# EAGLE design modular_expansion_system_esp32 (EAGLE 9.2.1)
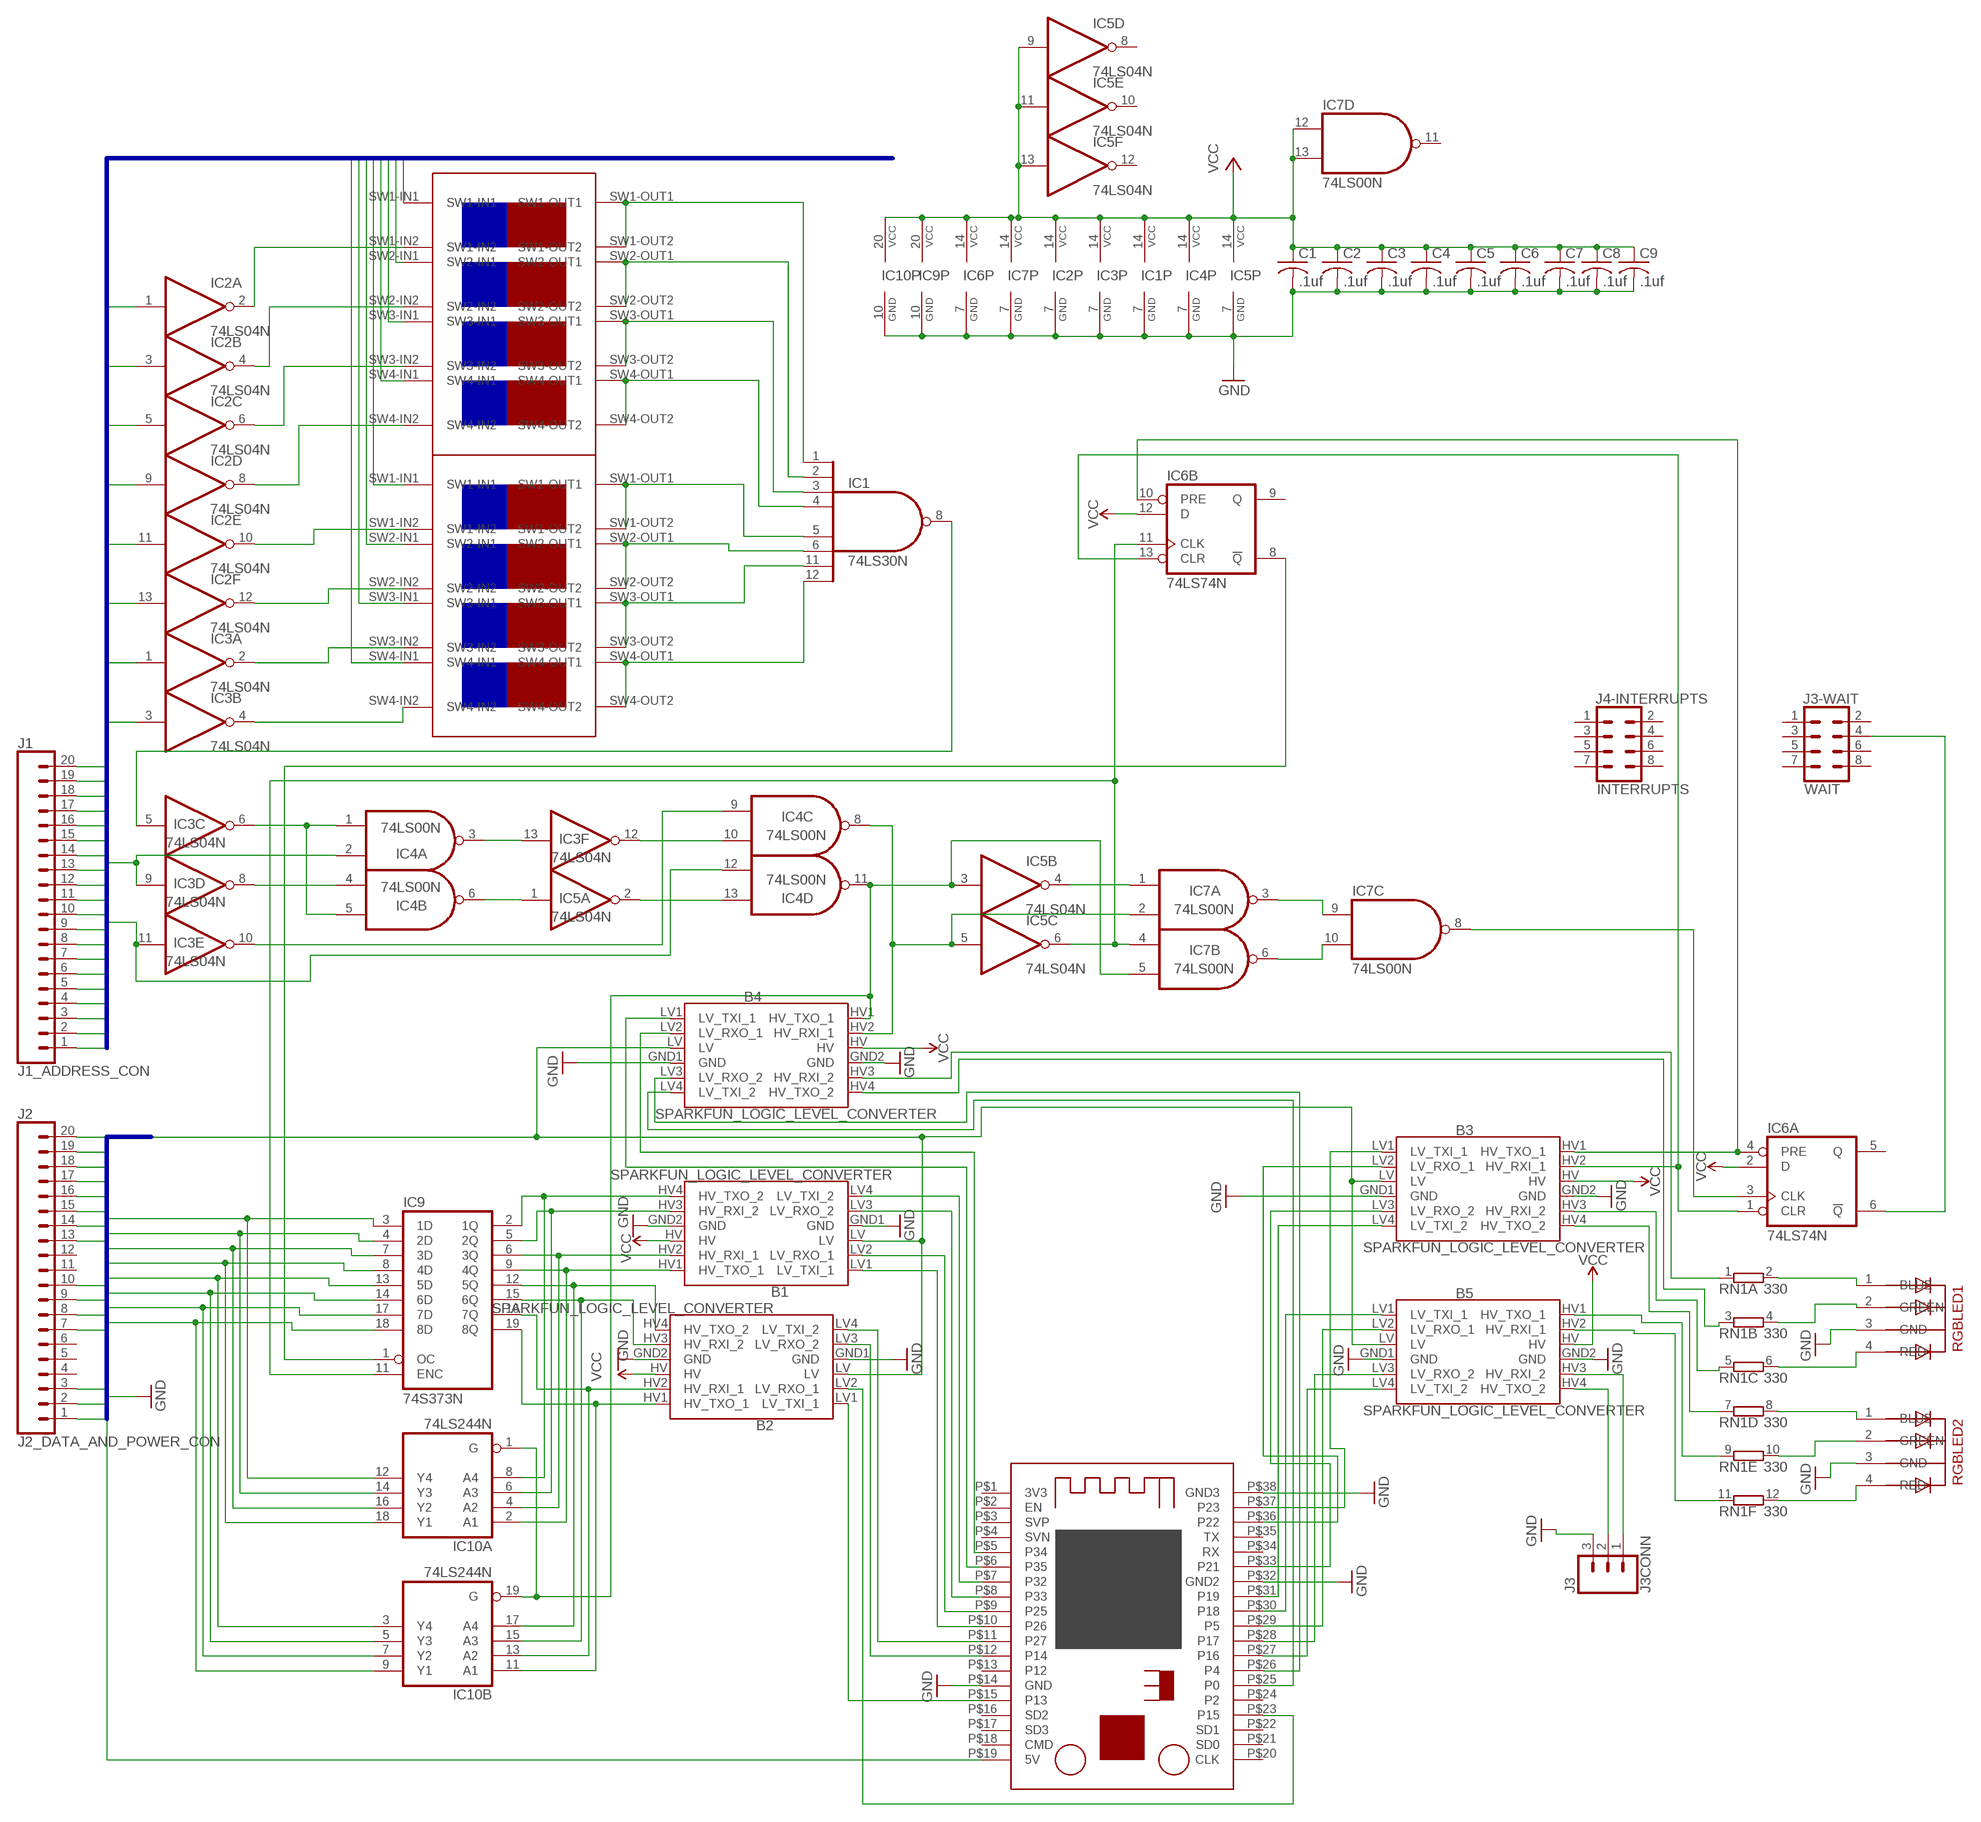
[diagram p0: schematic, sheet 1]

## Parts
B1  SPARKFUN_LOGIC_LEVEL_CONVERTER  [SPARKFUN_LOGIC_LEVEL_CONVERTER]
B2  SPARKFUN_LOGIC_LEVEL_CONVERTER  [SPARKFUN_LOGIC_LEVEL_CONVERTER]
B3  SPARKFUN_LOGIC_LEVEL_CONVERTER  [SPARKFUN_LOGIC_LEVEL_CONVERTER]
B4  SPARKFUN_LOGIC_LEVEL_CONVERTER  [SPARKFUN_LOGIC_LEVEL_CONVERTER]
B5  SPARKFUN_LOGIC_LEVEL_CONVERTER  [SPARKFUN_LOGIC_LEVEL_CONVERTER]
C1  .1uf  C-US025-025X050  [C025-025X050]
C2  .1uf  C-US025-025X050  [C025-025X050]
C3  .1uf  C-US025-025X050  [C025-025X050]
C4  .1uf  C-US025-025X050  [C025-025X050]
C5  .1uf  C-US025-025X050  [C025-025X050]
C6  .1uf  C-US025-025X050  [C025-025X050]
C7  .1uf  C-US025-025X050  [C025-025X050]
C8  .1uf  C-US025-025X050  [C025-025X050]
C9  .1uf  C-US025-025X050  [C025-025X050]
IC1  74LS30N  [DIL14]
IC2  74LS04N  [DIL14]
IC3  74LS04N  [DIL14]
IC4  74LS00N  [DIL14]
IC5  74LS04N  [DIL14]
IC6  74LS74N  [DIL14]
IC7  74LS00N  [DIL14]
IC9  74S373N  [DIL20]
IC10  74LS244N  [DIL20]
J1  J1_ADDRESS_CON  CONN_20  [1X20]
J2  J2_DATA_AND_POWER_CON  CONN_20  [1X20]
J3  J3CONN  CONN_03  [1X03]
J3-WAIT  WAIT  CONN_04X2  [2X4]
J4-INTERRUPTS  INTERRUPTS  CONN_04X2  [2X4]
RGBLED1  5MMRGBLED  [LED5MMRGB]
RGBLED2  5MMRGBLED  [LED5MMRGB]
RN1  330  E6R  [SIL12]
SW1  CTS206-124  [CTS206-124]
SW2  CTS206-124  [CTS206-124]
U$1  ESP32S  [ESP32S]

## Nets
A0: IC3.3(B:I) J1.1 SW1.SW4-IN1
A0_OR_NOT_A0: IC1.12(I7) SW1.SW4-OUT1 SW1.SW4-OUT2
A1: IC3.1(A:I) J1.2 SW1.SW3-IN1
A1_OR_NOT_A1: IC1.11(I6) SW1.SW3-OUT1 SW1.SW3-OUT2
A2: IC2.13(F:I) J1.3 SW1.SW2-IN1
A2_OR_NOT_A2: IC1.6(I5) SW1.SW2-OUT1 SW1.SW2-OUT2
A3: IC2.11(E:I) J1.4 SW1.SW1-IN1
A3_OR_NOT_A3: IC1.5(I4) SW1.SW1-OUT1 SW1.SW1-OUT2
A4: IC2.9(D:I) J1.5 SW2.SW4-IN1
A4_OR_NOT_A4: IC1.4(I3) SW2.SW4-OUT1 SW2.SW4-OUT2
A5: IC2.5(C:I) J1.6 SW2.SW3-IN1
A5_OR_NOT_A5: IC1.3(I2) SW2.SW3-OUT1 SW2.SW3-OUT2
A6: IC2.3(B:I) J1.7 SW2.SW2-IN1
A6_OR_NOT_A6: IC1.2(I1) SW2.SW2-OUT1 SW2.SW2-OUT2
A7: IC2.1(A:I) J1.8 SW2.SW1-IN1
A7_OR_NOT_A7: IC1.1(I0) SW2.SW1-OUT1 SW2.SW1-OUT2
A8: J1.9
A9: J1.10
A10: J1.11
A11: J1.12
A12: J1.13
A13: J1.14
A14: J1.15
A15: J1.16
ADDRESS_SELECTED: IC3.6(C:O) IC4.1(A:I0) IC4.5(B:I1)
ADDRESS_SELECTED_: IC1.8(O) IC3.5(C:I)
CAS*: J2.9
D0: IC9.18(8D) IC10.9(B:Y1) J2.20
D0_HV: B2.HV1(HV_TXO_1) IC9.19(8Q) IC10.11(B:A1)
D0_LV: B2.LV1(LV_TXI_1) U$1.P$15(P13)
D1: IC9.17(7D) IC10.7(B:Y2) J2.19
D1_HV: B2.HV2(HV_RXI_1) IC9.16(7Q) IC10.13(B:A2)
D1_LV: B2.LV2(LV_RXO_1) U$1.P$23(P15)
D2: IC9.14(6D) IC10.5(B:Y3) J2.18
D2_HV: B2.HV3(HV_RXI_2) IC9.15(6Q) IC10.15(B:A3)
D2_LV: B2.LV3(LV_RXO_2) U$1.P$12(P14)
D3: IC9.13(5D) IC10.3(B:Y4) J2.17
D3_HV: B2.HV4(HV_TXO_2) IC9.12(5Q) IC10.17(B:A4)
D3_LV: B2.LV4(LV_TXI_2) U$1.P$11(P27)
D4: IC9.8(4D) IC10.18(A:Y1) J2.16
D4_HV: B1.HV1(HV_TXO_1) IC9.9(4Q) IC10.2(A:A1)
D4_LV: B1.LV1(LV_TXI_1) U$1.P$10(P26)
D5: IC9.7(3D) IC10.16(A:Y2) J2.15
D5_HV: B1.HV2(HV_RXI_1) IC9.6(3Q) IC10.4(A:A2)
D5_LV: B1.LV2(LV_RXO_1) U$1.P$9(P25)
D6: IC9.4(2D) IC10.14(A:Y3) J2.14
D6_HV: B1.HV3(HV_RXI_2) IC9.5(2Q) IC10.6(A:A3)
D6_LV: B1.LV3(LV_RXO_2) U$1.P$8(P33)
D7: IC9.3(1D) IC10.12(A:Y4) J2.13
D7_HV: B1.HV4(HV_TXO_2) IC9.2(1Q) IC10.8(A:A4)
D7_LV: B1.LV4(LV_TXI_2) U$1.P$7(P32)
GND: B1.GND1(GND) B1.GND2(GND) B2.GND1(GND) B2.GND2(GND) B3.GND1(GND) B3.GND2(GND) B4.GND1(GND) B4.GND2(GND) B5.GND1(GND) B5.GND2(GND) C1.2 C2.2 C3.2 C4.2 C5.2 C6.2 C7.2 C8.2 C9.2 IC1.7(GND) IC2.7(P:GND) IC3.7(P:GND) IC4.7(P:GND) IC5.7(P:GND) IC6.7(P:GND) IC7.7(P:GND) IC9.10(GND) IC10.10(P:GND) J2.2 J3.3 RGBLED1.3(GND) RGBLED2.3(GND) U$1.P$14(GND) U$1.P$32(GND2) U$1.P$38(GND3)
IC6_CLR_HV: B3.HV2(HV_RXI_1) IC6.1(A:CLR) IC6.13(B:CLR)
IC6_PRE_HV: B3.HV1(HV_TXO_1) IC6.4(A:PRE) IC6.10(B:PRE)
IC6A_CLR_LV: B3.LV2(LV_RXO_1) U$1.P$36(P22)
IC6A_PRE_LV: B3.LV1(LV_TXI_1) U$1.P$37(P23)
IN: IC3.8(D:O) IC4.4(B:I0)
IN_: IC3.9(D:I) IC4.2(A:I1) J1.17
INTAK*: J2.7
N$12: IC3.13(F:I) IC4.3(A:O)
N$13: IC4.6(B:O) IC5.1(A:I)
N$14: IC3.12(F:O) IC4.10(C:I1)
N$15: IC4.13(D:I1) IC5.2(A:O)
N$20: IC7.3(A:O) IC7.9(C:I0)
N$21: IC7.6(B:O) IC7.10(C:I1)
N$23: B5.LV3(LV_RXO_2) U$1.P$28(P17)
N$24: B5.LV4(LV_TXI_2) U$1.P$27(P16)
N$41: B5.HV3(HV_RXI_2) J3.1
N$42: B5.HV4(HV_TXO_2) J3.2
NOT_A0: IC3.4(B:O) SW1.SW4-IN2
NOT_A1: IC3.2(A:O) SW1.SW3-IN2
NOT_A2: IC2.12(F:O) SW1.SW2-IN2
NOT_A3: IC2.10(E:O) SW1.SW1-IN2
NOT_A4: IC2.8(D:O) SW2.SW4-IN2
NOT_A5: IC2.6(C:O) SW2.SW3-IN2
NOT_A6: IC2.4(B:O) SW2.SW2-IN2
NOT_A7: IC2.2(A:O) SW2.SW1-IN2
OUT: IC3.10(E:O) IC4.9(C:I0)
OUT_: IC3.11(E:I) IC4.12(D:I0) J1.18
RAS*: J2.10
RD*: J1.19
RGBLED1_B: RGBLED1.1(BLUE) RN1.2
RGBLED1_B_5V: B4.HV3(HV_RXI_2) RN1.1
RGBLED1_B_LV: B4.LV3(LV_RXO_2) U$1.P$26(P4)
RGBLED1_G: RGBLED1.2(GREEN) RN1.4
RGBLED1_G_5V: B4.HV4(HV_TXO_2) RN1.3
RGBLED1_G_LV: B4.LV4(LV_TXI_2) U$1.P$25(P0)
RGBLED1_R: RGBLED1.4(RED) RN1.6
RGBLED1_R_5V: B3.HV3(HV_RXI_2) RN1.5
RGBLED1_R_LV: B3.LV3(LV_RXO_2) U$1.P$33(P21)
RGBLED2_B: RGBLED2.1(BLUE) RN1.8
RGBLED2_B_5V: B3.HV4(HV_TXO_2) RN1.7
RGBLED2_B_LV: B3.LV4(LV_TXI_2) U$1.P$31(P19)
RGBLED2_G: RGBLED2.2(GREEN) RN1.10
RGBLED2_G_5V: B5.HV1(HV_TXO_1) RN1.9
RGBLED2_G_LV: B5.LV1(LV_TXI_1) U$1.P$30(P18)
RGBLED2_R: RGBLED2.4(RED) RN1.12
RGBLED2_R_5V: B5.HV2(HV_RXI_1) RN1.11
RGBLED2_R_LV: B5.LV2(LV_RXO_1) U$1.P$29(P5)
SYSRES*: J2.8
VCC: B1.HV B2.HV B3.HV B4.HV B5.HV C1.1 C2.1 C3.1 C4.1 C5.1 C6.1 C7.1 C8.1 C9.1 IC1.14(VCC) IC2.14(P:VCC) IC3.14(P:VCC) IC4.14(P:VCC) IC5.9(D:I) IC5.11(E:I) IC5.13(F:I) IC5.14(P:VCC) IC6.2(A:D) IC6.12(B:D) IC6.14(P:VCC) IC7.12(D:I0) IC7.13(D:I1) IC7.14(P:VCC) IC9.20(VCC) IC10.20(P:VCC) J2.1 U$1.P$19(5V)
VCC/2: B1.LV B2.LV B3.LV B4.LV B5.LV J2.3
WAIT_: IC6.6(A:!Q) J3-WAIT.4
WIFI_IN: IC5.4(B:O) IC7.1(A:I0)
WIFI_IN_: B4.HV1(HV_TXO_1) IC4.11(D:O) IC5.3(B:I) IC7.5(B:I1) IC10.1(A:G) IC10.19(B:G)
WIFI_IN_LV_: B4.LV1(LV_TXI_1) U$1.P$6(P35)
WIFI_IN_OR_OUT: IC6.3(A:CLK) IC7.8(C:O)
WIFI_OUT: IC5.6(C:O) IC6.11(B:CLK) IC7.4(B:I0) IC9.11(ENC)
WIFI_OUT_: B4.HV2(HV_RXI_1) IC4.8(C:O) IC5.5(C:I) IC7.2(A:I1)
WIFI_OUT_LV_: B4.LV2(LV_RXO_1) U$1.P$5(P34)
WIFI_OUT_OUTPUT_ENABLE_: IC6.8(B:!Q) IC9.1(OC)
WR*: J1.20
Unconnected: IC5.8(D:O) IC5.10(E:O) IC5.12(F:O) IC6.5(A:Q) IC6.9(B:Q) IC7.11(D:O) J2.4 J2.5 J2.6 J2.11 J2.12 J3-WAIT.1 J3-WAIT.2 J3-WAIT.3 J3-WAIT.5 J3-WAIT.6 J3-WAIT.7 J3-WAIT.8 J4-INTERRUPTS.1 J4-INTERRUPTS.2 J4-INTERRUPTS.3 J4-INTERRUPTS.4 J4-INTERRUPTS.5 J4-INTERRUPTS.6 J4-INTERRUPTS.7 J4-INTERRUPTS.8 U$1.P$1(3V3) U$1.P$2(EN) U$1.P$3(SVP) U$1.P$4(SVN) U$1.P$13(P12) U$1.P$16(SD2) U$1.P$17(SD3) U$1.P$18(CMD) U$1.P$20(CLK) U$1.P$21(SD0) U$1.P$22(SD1) U$1.P$24(P2) U$1.P$34(RX) U$1.P$35(TX)

## Buses
J1_ADDRESS_CON:A0,A1,A2,A3,A4,A5,A6,A7,A8,A9,A10,A11,A12,A13,A14,A15,IN_,OUT_,RD*,WR*
J2_DATA_AND_POWER_CON:CAS*,D0,D1,D2,D3,D4,D5,D6,D7,GND,INTAK*,RAS*,SYSRES*,VCC,VCC/2

## Library data of the parts
B1-B5 = SparkFun-Boards:SPARKFUN_LOGIC_LEVEL_CONVERTER: SparkFun Logic Level Converter -Bi-Directional This is the mechnical outline for the 3.3V - 5V bi directional logic level converter. *Note, the "LOCK" Package has the header pins staggered by an offset of 5 mils (off center line), so that when you slide a row of standard 0.1" headers into the PTH pads, it will hold position vertically. See the follwing turorial for more information on this type of special footprints: Sneaky Footprints <https://www.sparkfun.com/tutorials/114> SparkFun Products: SparkFun Logic Level Converter - Bi-Directional <https://www.sparkfun.com/products/12009>
C1-C9 = rcl:C-US: CAPACITOR, American symbol; SPICEPREFIX: C
IC1 = 74xx-us:74*30: 8-input NAND gate
IC2 IC3 IC5 = 74xx-us:74*04: Hex INVERTER
IC4 IC7 = 74xx-us:74*00: Quad 2-input NAND gate
IC6 = 74xx-us:74*74: Dual D type positive edge triggered FLIP FLOP, preset and clear
IC9 = 74xx-us:74*373: Octal D type transparent LATCH, edge triggered
IC10 = 74xx-us:74*244: Octal BUFFER and LINE DRIVER, 3-state
J1 J2 = SparkFun-Connectors:CONN_20: Multi connection point. Often used as Generic Header-pin footprint for 0.1 inch spaced/style header connections On any of the 0.1 inch spaced packages, you can populate with these: Break Away Headers - Straight <https://www.sparkfun.com/products/116> (PRT-00116) Break Away Male Headers - Right Angle <https://www.sparkfun.com/products/553> (PRT-00553) Female Headers <https://www.sparkfun.com/products/115> (PRT-00115) Break Away Headers - Machine Pin <https://www.sparkfun.com/products/117> (PRT-00117) Break Away Female Headers - Swiss Machine Pin <https://www.sparkfun.com/products/743> (PRT-00743) For SCREWTERMINALS and SPRING TERMINALS visit here: Screw Terimnals on SparkFun.com <https://www.sparkfun.com/search/results?term=Screw+Terminals> (5mm/3.5mm/2.54mm spacing) This device is also useful as a general connection point to wire up your design to another part of your project. Our various solder wires solder well into these plated through hole pads. Hook-Up Wire - Assortment (Stranded, 22 AWG) <https://www.sparkfun.com/products/11375> (PRT-11375) Hook-Up Wire - Assortment (Solid Core, 22 AWG) <https://www.sparkfun.com/products/11367> (PRT-11367) View the entire wire category on our website here <https://www.sparkfun.com/categories/141> Special notes: Molex polarized connector foot print use with SKU : PRT-08231 with associated crimp pins and housings. 1MM SMD Version SKU: PRT-10208 NOTES ON THE VARIANTS LOCK and LOCK_LONGPADS... This footprint was designed to help hold the alignment of a through-hole component (i.e. 6-pin header) while soldering it into place. You may notice that each hole has been shifted either up or down by 0.005 of an inch from it's more standard position (which is a perfectly straight line). This slight alteration caused the pins (the squares in the middle) to touch the edges of the holes. Because they are alternating, it causes a "brace" to hold the component in place. 0.005 has proven to be the perfect amount of "off-center" position when using our standard breakaway headers. Although looks a little odd when you look at the bare footprint, once you have a header in there, the alteration is very hard to notice. Also,if you push a header all the way into place, it is covered up entirely on the bottom side. Note about LOCK SPECIAL package: This is just like the LOCK variant in that the holes are staggared by 5 mil, but except for the last two holes. They are not altered from the "standard" footprint layout. This is used for a special purpose on the layout of our Graphic LCD Backpack. Make sure you want to use this device before selecting it for you project!
J3 = SparkFun-Connectors:CONN_03: Multi connection point. Often used as Generic Header-pin footprint for 0.1 inch spaced/style header connections On any of the 0.1 inch spaced packages, you can populate with these: Break Away Headers - Straight <https://www.sparkfun.com/products/116> (PRT-00116) Break Away Male Headers - Right Angle <https://www.sparkfun.com/products/553> (PRT-00553) Female Headers <https://www.sparkfun.com/products/115> (PRT-00115) Break Away Headers - Machine Pin <https://www.sparkfun.com/products/117> (PRT-00117) Break Away Female Headers - Swiss Machine Pin <https://www.sparkfun.com/products/743> (PRT-00743) Stackable Header - 3 Pin (Female, 0.1") <https://www.sparkfun.com/products/13875> (PRT-13875) For SCREWTERMINALS and SPRING TERMINALS visit here: Screw Terimnals on SparkFun.com <https://www.sparkfun.com/search/results?term=Screw+Terminals> (5mm/3.5mm/2.54mm spacing) This device is also useful as a general connection point to wire up your design to another part of your project. Our various solder wires solder well into these plated through hole pads. Hook-Up Wire - Assortment (Stranded, 22 AWG) <https://www.sparkfun.com/products/11375> (PRT-11375) Hook-Up Wire - Assortment (Solid Core, 22 AWG) <https://www.sparkfun.com/products/11367> (PRT-11367) View the entire wire category on our website here <https://www.sparkfun.com/categories/141> Special notes: Molex polarized connector foot print use with SKU : PRT-08232 with associated crimp pins and housings.
J3-WAIT J4-INTERRUPTS = SparkFun-Connectors:CONN_04X2: Multi connection point. Often used as Generic Header-pin footprint for 0.1 inch spaced/style header connections On any of the 0.1 inch spaced packages, you can populate with these: Break Away Headers - Straight <https://www.sparkfun.com/products/116> (PRT-00116) Break Away Male Headers - Right Angle <https://www.sparkfun.com/products/553> (PRT-00553) Female Headers <https://www.sparkfun.com/products/115> (PRT-00115) Break Away Headers - Machine Pin <https://www.sparkfun.com/products/117> (PRT-00117) Break Away Female Headers - Swiss Machine Pin <https://www.sparkfun.com/products/743> (PRT-00743)
RGBLED1 RGBLED2 = adafruit:5MMRGBLED
RN1 = resistor-sil:E6R: SIL RESISTOR; OC_FARNELL: unknown; OC_NEWARK: unknown
SW1 SW2 = TMS99:CTS206-124: CTS 204-126
U$1 = TMS99:ESP32S: ESP32S

## Net classes
0 default: width 0.302 mm

## Board
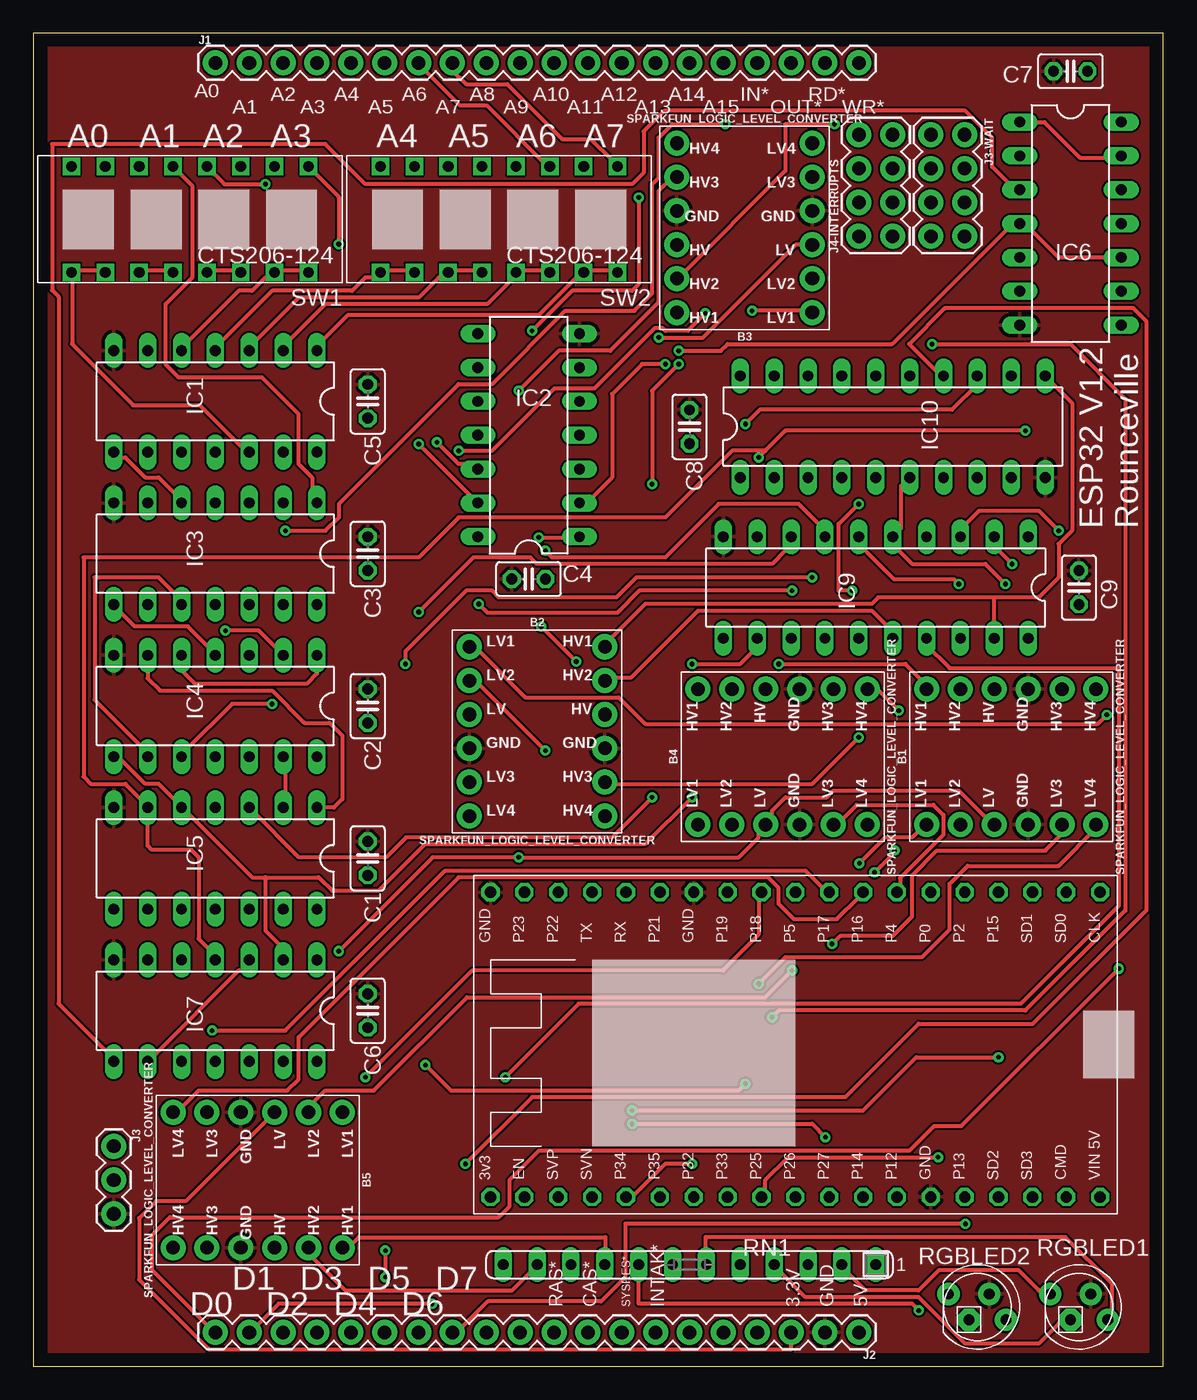
[diagram p1: board, top side]
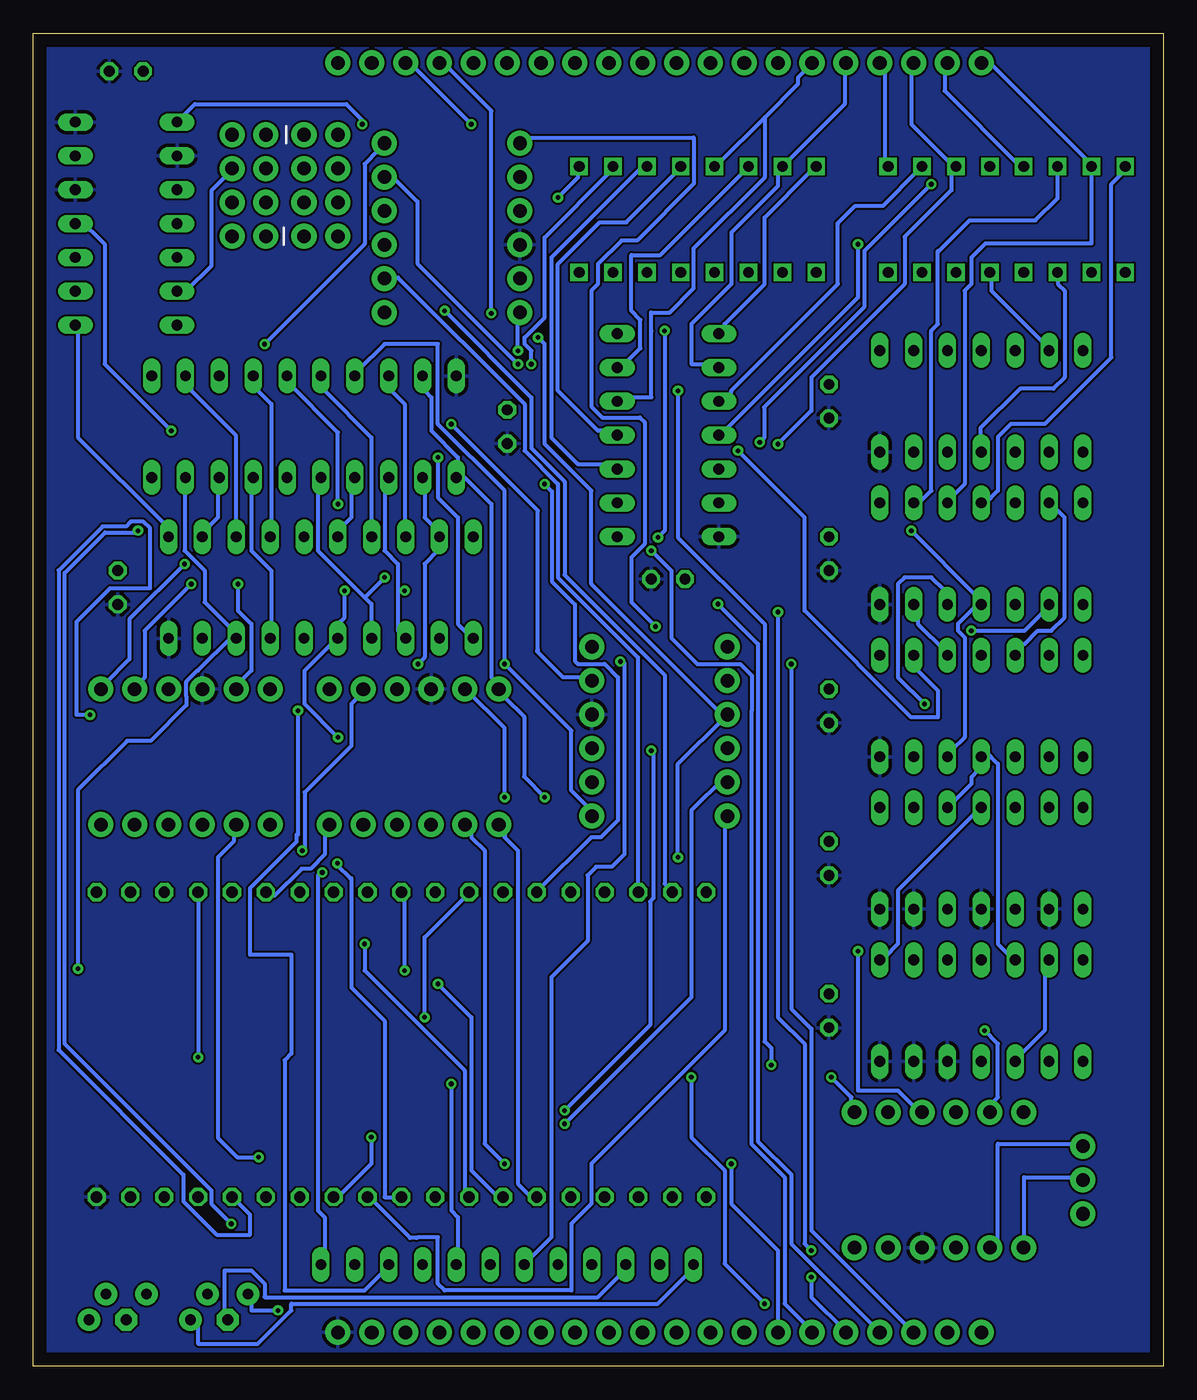
[diagram p2: board, bottom side, seen from below]

Size 84.75 x 100 mm. Coordinates in mm from the lower left corner, seen from the top.
Outline: 0,0 84.75,0 84.75,100 0,100 0,0
Copper layers (1*16): Top 0.035mm / dielectric 1.5mm / Bottom 0.035mm
Design rules "default": minimum track width 6mil, minimum drill 0.35mm, track to track 6mil, track to pad 6mil, pad to pad 6mil, via to via 6mil, smd to smd 6mil, copper to edge 40mil, drill to drill 6mil, minimum pad ring 10mil, minimum via ring 8mil, stop-mask expansion 4mil, vias tented up to drill 0mil, thermal gap 10mil

### Footprints (pad centres in the part's own frame; a part is rotated, then mirrored left to right if it is on the bottom)
SPARKFUN_LOGIC_LEVEL_CONVERTER = drill 1.016 pad 1.88: GND1 -5.08,-1.27; GND2 5.08,-1.27; HV 5.08,1.27; HV1 5.08,6.35; HV2 5.08,3.81; HV3 5.08,-3.81; HV4 5.08,-6.35; LV -5.08,1.27; LV1 -5.08,6.35; LV2 -5.08,3.81; LV3 -5.08,-3.81; LV4 -5.08,-6.35
C025-025X050 = drill 0.813 octagon: 1 -1.27,0; 2 1.27,0
DIL14 = drill 0.813 long: 1 -7.62,-3.81; 2 -5.08,-3.81; 3 -2.54,-3.81; 4 0,-3.81; 5 2.54,-3.81; 6 5.08,-3.81; 7 7.62,-3.81; 8 7.62,3.81; 9 5.08,3.81; 10 2.54,3.81; 11 0,3.81; 12 -2.54,3.81; 13 -5.08,3.81; 14 -7.62,3.81
DIL20 = drill 0.813 long: 1 -11.43,-3.81; 2 -8.89,-3.81; 3 -6.35,-3.81; 4 -3.81,-3.81; 5 -1.27,-3.81; 6 1.27,-3.81; 7 3.81,-3.81; 8 6.35,-3.81; 9 8.89,-3.81; 10 11.43,-3.81; 11 11.43,3.81; 12 8.89,3.81; 13 6.35,3.81; 14 3.81,3.81; 15 1.27,3.81; 16 -1.27,3.81; 17 -3.81,3.81; 18 -6.35,3.81; 19 -8.89,3.81; 20 -11.43,3.81
1X20 = drill 1.016 pad 1.88: 1 0,0; 2 2.54,0; 3 5.08,0; 4 7.62,0; 5 10.16,0; 6 12.7,0; 7 15.24,0; 8 17.78,0; 9 20.32,0; 10 22.86,0; 11 25.4,0; 12 27.94,0; 13 30.48,0; 14 33.02,0; 15 35.56,0; 16 38.1,0; 17 40.64,0; 18 43.18,0; 19 45.72,0; 20 48.26,0
1X03 = drill 1.016 pad 1.88: 1 0,0; 2 2.54,0; 3 5.08,0
2X4 = drill 1.016 pad 1.88: 1 -3.81,-1.27; 2 -3.81,1.27; 3 -1.27,-1.27; 4 -1.27,1.27; 5 1.27,-1.27; 6 1.27,1.27; 7 3.81,-1.27; 8 3.81,1.27
LED5MMRGB = drill 0.8 pad 1.676: 1 -2.159,0.968; 3 0.889,0.968; 4 2.159,-0.968 | drill 0.8 pad 1.676 octagon: 2 -0.635,-0.968
SIL12 = drill 0.813 long: 1 -13.97,0; 2 -11.43,0; 3 -8.89,0; 4 -6.35,0; 5 -3.81,0; 6 -1.27,0; 7 1.27,0; 8 3.81,0; 9 6.35,0; 10 8.89,0; 11 11.43,0; 12 13.97,0
CTS206-124 = drill 0.8 square: SW1-IN1 2.54,0.794; SW1-IN2 5.08,0.794; SW1-OUT1 2.54,8.731; SW1-OUT2 5.08,8.731; SW2-IN1 7.62,0.794; SW2-IN2 10.16,0.794; SW2-OUT1 7.62,8.731; SW2-OUT2 10.16,8.731; SW3-IN1 12.7,0.794; SW3-IN2 15.24,0.794; SW3-OUT1 12.7,8.731; SW3-OUT2 15.24,8.731; SW4-IN1 17.78,0.794; SW4-IN2 20.32,0.794; SW4-OUT1 17.78,8.731; SW4-OUT2 20.32,8.731
ESP32S = drill 0.85 octagon: P$1 1.27,46.99; P$2 1.27,44.45; P$3 1.27,41.91; P$4 1.27,39.37; P$5 1.27,36.83; P$6 1.27,34.29; P$7 1.27,31.75; P$8 1.27,29.21; P$9 1.27,26.67; P$10 1.27,24.13; P$11 1.27,21.59; P$12 1.27,19.05; P$13 1.27,16.51; P$14 1.27,13.97; P$15 1.27,11.43; P$16 1.27,8.89; P$17 1.27,6.35; P$18 1.27,3.81; P$19 1.27,1.27; P$20 24.13,1.27; P$21 24.13,3.81; P$22 24.13,6.35; P$23 24.13,8.89; P$24 24.13,11.43; P$25 24.13,13.97; P$26 24.13,16.51; P$27 24.13,19.05; P$28 24.13,21.59; P$29 24.13,24.13; P$30 24.13,26.67; P$31 24.13,29.21; P$32 24.13,31.75; P$33 24.13,34.29; P$34 24.13,36.83; P$35 24.13,39.37; P$36 24.13,41.91; P$37 24.13,44.45; P$38 24.13,46.99

### Placement (x,y rotation side)
B1  73.34,45.72 90 top
B2  37.78,47.62 0 top
B3  53.34,85.41 180 top
B4  56.2,45.72 90 top
B5  16.83,13.97 270 top
C1  25.08,38.1 90 top
C2  25.08,49.53 90 top
C3  25.08,60.96 90 top
C4  37.15,59.05 180 top
C5  25.08,72.39 90 top
C6  25.08,26.67 90 top
C7  77.79,97.16 180 top
C8  49.21,70.48 90 top
C9  78.42,58.42 90 top
IC1  13.65,72.39 180 top
IC2  37.15,69.85 90 top
IC3  13.65,60.96 180 top
IC4  13.65,49.53 180 top
IC5  13.65,38.1 180 top
IC6  77.79,85.72 270 top
IC7  13.65,26.67 180 top
IC9  63.18,58.42 180 top
IC10  64.45,70.48 0 top
J1  13.65,97.79 0 top
J2  61.91,2.54 180 top
J3  6.03,16.51 270 top
J3-WAIT  68.58,88.58 270 top
J4-INTERRUPTS  63.18,88.58 90 top
RGBLED1  78.42,4.45 0 top
RGBLED2  70.8,4.45 0 top
RN1  49.21,7.62 180 top
SW1  23.18,90.8 180 top
SW2  46.35,90.8 180 top
U$1  81.28,11.43 90 top

### Tracks (layer width: path | path; a pad name or v marks a point on that pad's centre or on a via)
A0
  Bottom 0.302: J1.1 13.4,98.18 5.41,90.18 SW1.SW4-IN1 5.41,89.68 5.41,84.24 13.35,84.24 14.4,83.18 14.4,81.18 14.9,80.68 14.9,66.18 15.9,65.18 IC3.3
A0_OR_NOT_A0
  Top 0.302: SW1.SW4-OUT1 4.91,82.18 2.9,82.18 SW1.SW4-OUT2 2.9,81.68 2.9,76.68 7.49,72.09 12.49,72.09 15.9,68.68 IC1.12
A1
  Top 0.302: IC3.1 20.91,65.18 20.91,66.68 19.91,67.68 19.91,71.44 17.16,74.18 10.9,74.18 9.9,75.18 9.9,79.69 9.91,79.69 11.9,81.68 11.9,88.58 SW1.SW3-IN1
  Bottom 0.302: SW1.SW3-IN1 10.9,90.18 16.41,95.68 16.41,97.68 J1.2
A1_OR_NOT_A1
  Top 0.302: SW1.SW3-OUT2 8.4,82.18 10.4,82.18 SW1.SW3-OUT1
  Bottom 0.302: IC1.11 13.72,68.65 13.72,70.36 10.74,73.34 8.24,73.34 7.41,74.18 7.41,80.68 7.91,81.18 7.91,81.68 SW1.SW3-OUT2
A2  (via drill 0.35)
  Top 0.302: v28.91,69.18 32.91,65.18 IC2.13
  Bottom 0.302: J1.3 18.91,97.68 18.91,93.18 15.9,90.18 SW1.SW2-IN1 15.9,89.68 15.9,88.23 19.41,84.73 19.41,81.18 26.41,74.18 26.41,71.68 v28.91,69.18
A2_OR_NOT_A2
  Top 0.302: SW1.SW2-OUT2 13.4,82.18 15.4,82.18 SW1.SW2-OUT1
  Bottom 0.302: IC1.6 8.9,76.68 12.9,80.68 12.9,81.68 SW1.SW2-OUT2
A3  (via drill 0.35)
  Top 0.302: SW1.SW1-IN1 22.91,87.74 v22.91,84.18
  Bottom 0.302: SW1.SW1-IN1 20.91,90.18 20.91,97.68 J1.4 | v22.91,84.18 22.91,80.18 32.91,70.18 IC2.11
A3_OR_NOT_A3
  Top 0.302: SW1.SW1-OUT1 20.41,82.18 18.41,82.18 SW1.SW1-OUT2 17.91,81.68 17.41,81.68 16.41,80.68 15.4,80.68 11.4,76.68 IC1.5
A4
  Bottom 0.302: J1.5 23.91,97.68 23.91,94.68 28.41,90.18 SW2.SW4-IN1 28.91,89.68 28.91,88.55 32.41,85.05 32.41,81.18 35.41,78.18 35.41,75.18 33.41,75.18 IC2.9
A4_OR_NOT_A4
  Top 0.302: SW2.SW4-OUT1 28.41,82.18 26.41,82.18 SW2.SW4-OUT2 25.91,81.68 24.91,81.68 23.91,80.68 17.91,80.68 13.9,76.68 IC1.4
A5
  Bottom 0.302: 29.91,93.68 27.41,96.18 27.41,96.68 26.41,97.68 J1.6 | 29.91,93.68 33.41,90.18 SW2.SW3-IN1 | 29.91,93.68 29.91,89.18 35.22,83.86 35.22,80.86 37.03,79.06 38.42,79.06 38.42,77.69 38.41,77.68 38.41,72.68 40.91,72.68 IC2.5
A5_OR_NOT_A5
  Top 0.302: SW2.SW3-OUT1 33.41,82.18 31.41,82.18 SW2.SW3-OUT2 30.91,81.68 30.41,81.68 28.91,80.18 19.91,80.18 16.41,76.68 IC1.3
A6
  Top 0.302: SW2.SW2-IN1 38.41,90.18 33.99,94.59 31.99,94.59 28.91,97.68 J1.7
  Bottom 0.302: IC2.3 41.41,67.68 43.91,67.68 45.91,69.68 45.91,83.18 38.91,90.18 SW2.SW2-IN1
A6_OR_NOT_A6
  Top 0.302: SW2.SW2-OUT1 38.41,82.18 36.41,82.18 SW2.SW2-OUT2 36.2,81.84 34.04,79.68 21.91,79.68 18.91,76.68 IC1.2
A7  (via drill 0.35)
  Top 0.302: J1.8 31.43,97.2 32.45,96.18 35.56,96.18 39.67,92.07 41.82,92.07 43.41,90.49 43.41,90.18 SW2.SW1-IN1 | v37.91,62.18 40.91,62.18 IC2.1 | v37.41,77.68 40.41,80.68 44.91,80.68 45.41,81.18 v45.41,87.68
  Bottom 0.302: v37.91,62.18 37.41,62.68 v37.41,77.68 | v45.41,87.68 43.91,89.18 43.91,89.68 SW2.SW1-IN1
A7_OR_NOT_A7
  Top 0.302: SW2.SW1-OUT1 43.41,82.18 41.41,82.18 SW2.SW1-OUT2 40.91,81.68 40.72,81.68 37.91,78.86 23.59,78.86 21.41,76.68 IC1.1
ADDRESS_SELECTED
  Top 0.302: IC4.5 11.11,52.21 12.13,51.18 20.49,51.18 21.27,51.96 IC4.1
  Bottom 0.302: IC3.6 8.4,64.68 7.41,63.68 7.41,56.18 8.4,55.18 9.4,55.18 10.4,54.18 10.9,54.18 10.9,53.68 IC4.5
ADDRESS_SELECTED_
  Top 0.302: IC3.5 10.9,65.18 9.4,66.68 8.4,66.68 6.91,68.18 6.41,68.18 IC1.8
D0  (via drill 0.35)
  Top 0.302: v81.41,29.82 69.61,18.02 67.56,18.02 65.72,16.18 37.94,16.18 35.72,13.97 35.72,12 34.91,11.18 10.24,11.18 8.9,9.84 8.9,7.18 13.4,2.68 J2.20
  Bottom 0.302: IC10.9 73.41,66.18 73.41,61.18 71.91,59.68 71.91,57.32 69.59,55 69.91,54.68 | v81.41,29.82 81.41,43.23 77.72,46.92 75.95,46.92 73.27,49.6 73.27,50.24 73.32,50.29 73.32,51.32 73.27,51.36 72.45,52.18 72.41,52.18 69.91,54.68 | 69.91,54.68 IC9.18
D0_HV
  Top 0.302: 72.07,57.68 75.41,57.68 76.91,59.18 76.91,61.68 77.91,62.68 77.91,72.27 IC10.11 | 72.07,57.68 63.37,57.68 62.87,57.18 45.91,57.18 42.91,54.18 B2.HV1 | IC9.19 72.07,57.68
D0_LV  (via drill 0.35)
  Top 0.302: B2.LV1 32.91,53.68 33.41,53.68 36.91,50.18 43.91,50.18 45.91,48.18 79.82,48.18 v80.5,48.87
  Bottom 0.302: v80.5,48.87 81.5,48.87 81.5,55.87 79,58.37 76,58.37 76,62.87 76.5,63.37 77.47,63.37 77.47,63.32 77.79,63 79.56,63 82.86,59.71 82.86,23.72 73.5,14.37 73.5,12.37 71,9.87 68.5,9.87 68.5,11.37 69.5,12.37 U$1.P$15
D1  (via drill 0.35)
  Top 0.302: v29.91,4.68 18.41,4.68 16.41,2.68 J2.19 | v35.41,21.68 40.91,27.18 74.04,27.18 81.41,34.55 81.41,52.37 68.72,52.37 66.91,54.18 IC9.17
  Bottom 0.302: IC9.17 66.91,54.68 66.91,59.68 68.41,61.18 68.41,66.18 IC10.7 | v29.91,4.68 32.91,7.68 32.91,14.68 35.41,17.18 v35.41,21.68
D1_HV  (via drill 0.35)
  Top 0.302: IC9.16 64.41,54.68 64.41,55.14 62.87,56.68 49.86,56.68 44.86,51.68 42.91,51.68 B2.HV2 | IC10.13 70.8,73.66 68.9,71.75 54.48,71.75 v53.41,70.68
  Bottom 0.302: v53.41,70.68 46.91,64.18 46.91,53.74 46.99,53.66 45.02,51.68 42.91,51.68 B2.HV2
D1_LV  (via drill 0.35)
  Top 0.302: v44.91,19.18 62.23,19.18 66.22,23.18 v72.39,23.18 | v38.41,46.18 33.41,51.18 32.91,51.18 B2.LV2
  Bottom 0.302: v44.91,19.18 38.49,25.6 38.5,25.61 38.5,34.87 38.25,35.12 38.25,46.12 v38.41,46.18 | U$1.P$23 v72.39,23.18
D2  (via drill 0.35)
  Top 0.302: v27.91,52.68 27.91,53.64 32.45,58.18 34.41,58.18 34.91,57.68 43.73,57.68 45.23,59.18 v58.41,59.18
  Bottom 0.302: 59.91,57.68 63.41,61.18 63.41,66.18 IC10.5 | 59.91,57.68 59.41,57.18 59.41,54.68 IC9.14 | v27.91,52.68 27.91,26.82 26.41,25.32 26.41,10.18 18.91,2.68 J2.18 | 59.91,57.68 v58.41,59.18
D2_HV  (via drill 0.35)
  Top 0.302: v61.91,47.18 58.41,43.68 42.91,43.68 B2.HV3 | v61.91,64.68 60.41,63.18 60.41,58.18 v61.41,58.18
  Bottom 0.302: v61.91,47.18 64.41,49.68 64.41,52.18 62.41,54.18 IC9.15 61.91,54.68 61.91,55.68 61.41,56.18 v61.41,58.18 | IC10.15 65.72,73.86 61.91,70.05 v61.91,64.68
D2_LV  (via drill 0.35)
  Top 0.302: v59.41,17.18 58.41,18.18 v44.91,18.18
  Bottom 0.302: v59.41,17.18 59.41,15.18 61.91,12.68 62,12.62 U$1.P$12 | v44.91,18.18 35.41,27.68 35.41,41.68 32.91,44.18 B2.LV3
D3  (via drill 0.35)
  Top 0.302: v56.91,58.18 45.45,58.18 43.81,56.55 43.81,56.52 34.07,56.52 v33.41,57.18
  Bottom 0.302: IC9.13 57.41,55.18 57.41,58.18 | 57.41,58.18 57.41,60.18 58.41,61.18 58.41,66.18 IC10.3 | v33.41,57.18 30.41,54.18 30.41,16.88 27.91,14.38 27.91,9.18 21.41,2.68 J2.17 | 57.41,58.18 v56.91,58.18
D3_HV  (via drill 0.35)
  Top 0.302: v49.41,52.68 53.02,52.68 53.91,53.57 53.91,54.18 IC9.12
  Bottom 0.302: B2.HV4 42.91,41.68 44.41,43.18 44.41,47.68 v49.41,52.68 49.41,65.68 54.41,70.68 54.41,76.68 58.41,76.68 60.41,74.68 IC10.17
D3_LV
  Bottom 0.302: B2.LV4 32.91,41.18 32.91,25.18 42.91,15.18 42.91,12.18 44.41,10.68 44.41,5.68 53.91,5.68 54.41,6.18 54.41,9.68 55.91,9.68 56,9.62 56.5,9.62 59.5,12.62 U$1.P$11
D4  (via drill 0.35)
  Top 0.302: v26.41,8.68 v26.41,6.68 | v28.91,56.59 33,60.68 37.27,60.68 37.77,60.18 55.41,60.18 56.41,61.18 56.41,62.18 IC9.8
  Bottom 0.302: IC9.8 56.91,62.68 56.91,72.18 57.91,73.18 57.91,74.18 IC10.18 | v26.41,6.68 26.41,5.18 23.91,2.68 J2.16 | v26.41,8.68 26.91,9.18 26.91,24.18 28.91,26.18 v28.91,56.59
D4_HV  (via drill 0.35)
  Top 0.302: v55.91,52.68 65.41,52.68 66.91,51.18 B1.HV1
  Bottom 0.302: IC10.2 55.41,66.18 55.41,63.68 54.41,62.68 IC9.9 54.41,62.18 54.41,61.18 55.41,60.18 55.41,53.18 v55.91,52.68
D4_LV  (via drill 0.35)
  Top 0.302: v61.95,37.73 63.91,39.68 65.91,39.68 66.93,40.71 B1.LV1
  Bottom 0.302: U$1.P$10 57.25,12.62 57.5,12.62 57.5,12.68 58.41,12.68 58.41,25.91 60.91,28.41 60.91,36.62 61,36.62 62,37.62 v61.95,37.73
D5  (via drill 0.35)
  Top 0.302: v38.41,61.18 38.91,60.68 47.41,60.68 51.41,64.68 57.41,64.68 59.41,62.68 IC9.7
  Bottom 0.302: IC9.7 59.41,62.68 59.41,69.68 62.91,73.18 62.91,74.18 IC10.16 | v38.41,61.18 36.91,59.68 36.91,54.64 34.95,52.68 31.73,52.68 30.86,51.82 30.86,49.23 30.91,49.18 30.91,16.68 28.41,14.18 28.41,4.68 26.41,2.68 J2.15
D5_HV  (via drill 0.35)
  Top 0.302: v69.41,58.68 69.04,59.05 64.54,59.05 62.41,61.18 62.41,62.18 IC9.6
  Bottom 0.302: IC9.6 61.91,62.68 60.91,63.68 60.91,66.18 IC10.4 | v69.41,58.68 69.41,56.68 68.41,55.68 68.41,52.18 69.41,51.18 B1.HV2
D5_LV  (via drill 0.35)
  Top 0.302: U$1.P$9 54.75,12.87 54.91,12.87 54.91,13.97 56.62,15.68 v67.86,15.68
  Bottom 0.302: v67.86,15.68 69.44,15.68 70.91,17.14 70.91,38.18 69.72,39.37 69.72,40.45 B1.LV2
D6  (via drill 0.35)
  Top 0.302: v32.41,15.18 37.41,20.18 60.91,20.18 66.41,25.68 74.95,25.68 83.5,34.23 83.5,78.36 82.5,79.36 68.36,79.36 65.68,76.68 68,74.36 IC10.14
  Bottom 0.302: IC9.4 66.91,62.68 66.91,72.18 67.91,73.18 67.91,74.18 IC10.14 | v32.41,15.18 32.41,12.18 28.91,8.68 28.91,2.68 J2.14
D6_HV  (via drill 0.35)
  Top 0.302: v72.91,58.68 71.41,60.18 65.91,60.18 64.91,61.18 64.91,62.18 IC9.5 65.09,62.87 65.09,66.04 IC10.6
  Bottom 0.302: v72.91,58.68 76.41,55.18 76.41,51.68 76.91,51.18 B1.HV3
D6_LV  (via drill 0.35)
  Top 0.302: v59.91,31.68 60.5,32.28 64.45,32.28 65.91,33.73 65.91,36.83 67.76,38.68 75.91,38.68 77.41,40.18 B1.LV3
  Bottom 0.302: v59.91,31.68 59.91,29.68 52.41,22.18 52.41,12.87 52.25,12.87 U$1.P$8
D7  (via drill 0.35)
  Top 0.302: v69.91,10.68 44.41,10.68 44.41,6.68 42.59,4.87 34.09,4.87 31.91,2.68 J2.13 | v76.91,62.68 75.41,64.18 70.95,64.18 69.53,62.76 IC9.3
  Bottom 0.302: IC9.3 69.59,62.3 69.59,69.86 72.91,73.18 72.91,74.18 IC10.12 | v69.91,10.68 71.41,12.18 71.41,13.18 82.41,24.18 82.41,59.52 79.38,62.55 77.04,62.55 v76.91,62.68
D7_HV  (via drill 0.35)
  Top 0.302: v73.41,60.18 72.41,61.18 72.41,62.18 IC9.2
  Bottom 0.302: IC9.2 71.91,62.68 70.91,63.68 70.91,66.18 IC10.8 | v73.41,60.18 77.54,56.05 77.54,53.05 79.41,51.18 B1.HV4
D7_LV  (via drill 0.35)
  Top 0.302: v54.41,28.68 56.41,30.68 66.63,30.68 68.72,32.78 68.72,36.2 70.08,37.55 76.91,37.55 79.69,40.34 B1.LV4
  Bottom 0.302: v54.41,28.68 51.91,26.18 51.91,14.68 50.04,12.82 50,12.87 49.75,12.87 U$1.P$7
GND
  pour Top: 0.64,0 84.77,0 84.77,100.33 0.64,100.33
IC6_CLR_HV  (via drill 0.35)
  Top 0.302: IC6.13 81.41,90.68 78.49,90.68 75.83,93.34 IC6.1 | v60.09,93.18 56.41,93.18 56.41,89.68 48.41,81.68 B3.HV2
  Bottom 0.302: v60.09,93.18 60.09,93.5 61.27,94.68 72.64,94.68 IC6.1
IC6_PRE_HV  (via drill 0.35)
  Top 0.302: IC6.10 81.41,83.18 76.91,83.18 74.41,85.68 IC6.4 73.91,85.68 73.41,85.68 64.41,76.68 52.07,76.68 51.57,76.18 v48.41,76.18
  Bottom 0.302: v48.41,76.18 48.41,78.68 B3.HV1
IC6A_CLR_LV
  Bottom 0.302: B3.LV2 58.41,81.68 57.41,81.68 47.91,72.18 47.91,68.68 45.41,66.18 45.41,59.18 39.41,53.18 39.41,35.68 39.5,35.62 U$1.P$36
IC6A_PRE_LV  (via drill 0.35)
  Top 0.302: v53.91,79.18 58.41,79.18 B3.LV1
  Bottom 0.302: v53.91,79.18 47.41,72.68 47.41,68.86 44.91,66.36 44.91,59.37 37.41,51.87 37.41,36.18 36.92,35.7 37,35.62 U$1.P$37
IN
  Top 0.302: IC3.8 6.41,56.68 7.59,55.5 11.59,55.5 13.69,53.4 IC4.4
IN_  (via drill 0.35)
  Top 0.302: v14.4,55.18 16.91,55.18 IC4.2 | v50.41,79 49.09,77.68 47.41,77.68 47.22,77.87 46.59,77.87 42.09,73.36 39.09,73.36 34.41,68.68 v31.91,68.68
  Bottom 0.302: v14.4,55.18 10.4,55.18 8.9,56.68 IC3.9 | v50.41,79 50.41,94.18 53.91,97.68 J1.17 | v31.91,68.68 26.91,63.68 26.91,56.68 18.91,48.68 16.91,48.68 16.91,50.68 18.41,52.18 18.41,53.18 IC4.2
N$12
  Bottom 0.302: IC4.3 16.41,53.68 18.41,55.68 18.41,56.68 IC3.13
N$13
  Top 0.302: IC4.6 8.57,51.61 9.5,50.68 17.91,50.68 20.33,48.26 22.23,48.26 23.18,47.31 23.18,42.55 22.54,41.91 IC5.1
N$14  (via drill 0.35)
  Top 0.302: v17.91,49.68 14.9,49.68 11.4,46.18 IC4.10
  Bottom 0.302: v17.91,49.68 19.91,51.68 19.91,58.68 19.41,59.18 17.41,59.18 16.41,58.18 16.41,57.18 IC3.12
N$15
  Top 0.302: IC5.2 18.91,42.18 18.91,45.68 IC4.13
N$20
  Top 0.302: IC7.9 8.9,23.18 15.4,29.68 15.9,29.68 16.41,30.18 IC7.3
N$21
  Bottom 0.302: IC7.10 10.9,23.18 8.9,25.18 8.9,30.18 IC7.6
N$23  (via drill 0.35)
  Top 0.302: v13.4,25.18 18.91,25.18 30.91,37.18 57.91,37.18 59.41,35.68 59.5,35.62 U$1.P$28
  Bottom 0.302: v13.4,25.18 12.4,24.18 12.4,20.18 12.9,19.68 12.9,19.18 B5.LV3
N$24
  Top 0.302: B5.LV4 10.9,19.18 12.4,20.68 19.05,20.68 19.91,21.54 19.91,24.68 31.91,36.68 55.1,36.68 55.91,35.88 55.91,34.68 57.04,33.55 60.27,33.55 61.91,35.18 62,35.12 62,35.37 U$1.P$27
N$41
  Bottom 0.302: J3.1 6.41,16.68 12.4,16.68 12.4,9.18 12.9,8.68 B5.HV3
N$42
  Bottom 0.302: J3.2 6.41,14.18 10.45,14.18 10.45,9.02 B5.HV4
NOT_A0
  Bottom 0.302: SW1.SW4-IN2 2.9,89.68 3.9,88.68 3.9,75.68 8.9,70.68 11.43,70.68 12.4,69.71 12.4,65.68 13.4,64.68 IC3.4
NOT_A1
  Bottom 0.302: IC3.2 18.41,64.68 17.41,65.68 17.41,77.68 16.91,78.18 16.91,83.68 16.81,83.68 14.53,85.96 9.6,85.96 7.94,87.63 SW1.SW3-IN2
NOT_A2  (via drill 0.35)
  Top 0.302: v17.41,88.68 14.29,88.68 14.29,88.74 SW1.SW2-IN2 | v30.27,69.32 31.91,67.68 32.91,67.68 IC2.12
  Bottom 0.302: v17.41,88.68 22.41,83.68 22.41,79.5 29.95,71.95 29.95,69.63 v30.27,69.32
NOT_A3
  Bottom 0.302: SW1.SW1-IN2 18.41,89.68 21.02,87.06 23.11,87.06 24.45,85.72 24.41,85.68 24.41,81.18 32.41,73.18 32.41,72.68 32.91,72.18 IC2.10
NOT_A4
  Bottom 0.302: SW2.SW4-IN2 26.41,89.68 29.91,86.18 29.91,81.18 32.91,78.18 32.91,77.68 IC2.8
NOT_A5
  Bottom 0.302: SW2.SW3-IN2 31.41,89.68 37.72,83.36 39.91,83.36 39.91,79.18 39.22,78.5 39.22,76.36 40.91,74.68 IC2.6
NOT_A6
  Bottom 0.302: SW2.SW2-IN2 36.41,89.68 40.27,85.82 42.27,85.82 45.41,82.68 45.41,73.18 42.41,70.18 41.41,70.18 IC2.4
NOT_A7  (via drill 0.35)
  Top 0.302: IC2.2 41.41,65.18 41.91,65.18 43.41,66.68 43.41,72.93 45.66,75.18 v47.41,75.18
  Bottom 0.302: v47.41,75.18 47.41,76.18 47.91,76.68 47.91,77.18 46.41,78.68 46.41,84.68 41.41,89.68 SW2.SW1-IN2
OUT
  Top 0.302: IC4.9 8.4,46.18 4.59,50 4.59,59.18 9.4,59.18 11.4,57.18 IC3.10
OUT_  (via drill 0.35)
  Top 0.302: v51.91,93.18 47.91,93.18 46.91,92.18 46.91,89.18 46.41,88.68 46.41,80.5 45.09,79.18 39.91,79.18 34.41,73.68 31.91,73.68 22.93,64.7 22.93,63.7 21.91,62.68 v18.91,62.68
  Bottom 0.302: 13.9,57.18 15.4,55.68 15.4,55.18 14.9,54.68 14.9,47.18 15.9,46.18 IC4.12 | v51.91,93.18 56.41,97.68 J1.18 | v18.91,62.68 13.9,57.68 13.9,57.18 | 13.9,57.18 IC3.11
RGBLED1_B
  Top 0.302: RN1.2 60.91,7.18 62.41,5.68 66.41,5.68 67.91,7.18 73.91,7.18 75.41,5.68 75.91,5.68 RGBLED1.1
RGBLED1_B_5V  (via drill 0.35)
  Top 0.302: v63.09,37.05 64.59,38.55 v64.59,38.68
  Bottom 0.302: v64.59,38.68 64.41,38.87 64.41,43.05 60.91,46.55 60.91,49.68 60.41,50.18 60.41,50.68 B4.HV3 | RN1.1 62.91,7.68 62.91,11.18 63.41,11.68 63.41,36.83 63.19,37.05 v63.09,37.05
RGBLED1_B_LV
  Top 0.302: U$1.P$26 65,35.62 65,36.62 68.25,39.87 68.25,41.37 67.5,42.12 61.75,42.12 60.25,40.62 B4.LV3
RGBLED1_G
  Top 0.302: RN1.4 55.91,7.18 57.91,5.18 66.41,5.18 69.91,1.68 75.41,1.68 76.91,3.18 77.41,3.18 RGBLED1.2
RGBLED1_G_5V  (via drill 0.35)
  Top 0.302: v64.91,49.18 63.41,50.68 62.91,50.68 B4.HV4
  Bottom 0.302: v64.91,49.18 64.91,39.87 65,39.87 65,39.37 68.5,35.87 68.5,30.86 65.41,30.86 65.41,23.46 65.91,22.96 65.91,5.68 59.91,5.68 58.41,7.18 RN1.3
RGBLED1_G_LV
  Bottom 0.302: B4.LV4 62.91,40.18 62.91,38.38 63.96,37.32 64.63,37.32 66.67,35.28 66.75,35.37 67.25,35.37 U$1.P$25
RGBLED1_R
  Top 0.302: RN1.6 50.41,7.68 50.41,9.68 77.41,9.68 80.91,6.18 80.91,3.68 RGBLED1.4
RGBLED1_R_5V  (via drill 0.35)
  Top 0.302: v53.41,21.18 52.91,20.68 31.32,20.68 v29.41,22.59 | v36.41,73.18 39.41,76.18 43.27,76.18 46.91,79.82 46.91,88.18 47.94,89.22 B3.HV3
  Bottom 0.302: v53.41,21.18 53.41,11.68 52.91,11.18 52.91,7.68 RN1.5 | v29.41,22.59 29.41,23.86 29.91,24.36 29.91,55.68 36.41,62.18 v36.41,73.18
RGBLED1_R_LV  (via drill 0.35)
  Top 0.302: v46.41,66.18 46.41,73.18 v48.41,75.18
  Bottom 0.302: v48.41,75.18 55.95,82.73 55.95,87.38 57.78,89.22 B3.LV3 | U$1.P$33 47,35.62 46.91,35.68 42.91,39.68 42.18,39.68 40.91,40.96 40.91,51.68 41.91,52.68 43.91,52.68 44.13,52.91 44.13,57.15 45.86,58.88 45.86,65.64 v46.41,66.18
RGBLED2_B  (via drill 0.35)
  Top 0.302: v66.41,4.18 65.91,4.68 45.41,4.68 45.41,7.18 RN1.8
  Bottom 0.302: v66.41,4.18 68.41,4.18 68.41,5.18 RGBLED2.1
RGBLED2_B_5V  (via drill 0.35)
  Top 0.302: v38.09,55.5 v40.72,52.87
  Bottom 0.302: v38.09,55.5 39.91,57.32 39.91,60.68 38.91,61.68 38.91,70.82 39.27,71.18 42.09,71.18 42.91,72 42.91,80.68 42.41,81.18 42.41,82.68 40.64,84.45 39.47,84.45 35.24,88.68 35.22,88.68 35.22,92.18 47.91,92.18 B3.HV4 | RN1.7 47.91,7.68 45.91,9.68 45.91,29.18 43.18,31.91 43.18,36.83 42.55,37.47 41.36,37.47 40.41,38.42 40.41,52.71 40.56,52.87 v40.72,52.87
RGBLED2_B_LV  (via drill 0.35)
  Top 0.302: v55.41,26.18 55.91,26.68 74.41,26.68 81.91,34.18 81.91,72.56 77.79,76.68 v67.41,76.68
  Bottom 0.302: v55.41,26.18 55.41,32.18 52.49,35.1 52.5,35.12 52.25,35.37 U$1.P$31 | v67.41,76.68 59.91,84.18 59.91,90.18 58.91,91.18 58.91,91.68 B3.LV4
RGBLED2_G
  Bottom 0.302: RN1.10 40.41,7.18 42.41,5.18 67.41,5.18 67.41,6.18 68.41,7.18 70.41,7.18 70.41,3.68 RGBLED2.2
RGBLED2_G_5V
  Top 0.302: RN1.9 42.91,7.68 42.91,9.68 24.41,9.68 23.91,9.18 23.41,9.18 B5.HV1
RGBLED2_G_LV  (via drill 0.35)
  Top 0.302: v24.91,21.68 32.91,29.68 51.75,29.68 51.75,29.73 54.41,32.39 54.41,35.12 54.5,35.12 54.5,35.37 U$1.P$30
  Bottom 0.302: v24.91,21.68 23.41,20.18 23.41,19.18 B5.LV1
RGBLED2_R
  Bottom 0.302: RN1.12 35.41,7.18 37.91,4.68 65.41,4.68 65.41,4.18 67.91,1.68 72.41,1.68 72.41,3.18 72.91,3.68 RGBLED2.4
RGBLED2_R_5V
  Top 0.302: RN1.11 37.41,7.18 35.91,5.68 23.41,5.68 20.41,8.68 B5.HV2
RGBLED2_R_LV  (via drill 0.35)
  Top 0.302: v56.91,29.68 54.91,27.68 32.54,27.68 25.54,20.68 21.91,20.68 20.41,19.18 B5.LV2
  Bottom 0.302: v56.91,29.68 56.91,35.12 57,35.12 57,35.37 U$1.P$29
VCC
  pour Bottom: 0.32,0 84.77,0 84.77,100.33 0.32,100.33
VCC/2  (via drill 0.35)
  Top 0.302: B3.LV 57.18,84.14 50.22,77.18 v46.91,77.18 | B1.LV 71.91,40.68 69.41,43.18 60.01,43.18 59.51,42.68 56.41,42.68 55.41,41.68 55.41,40.68 B4.LV 54.91,40.18 54.41,40.18 54.41,39.68 52.91,38.18 v36.41,38.18 29.95,38.18 v22.91,31.13 | B5.LV 11.43,12.38 9.21,12.38 7.94,11.11 7.94,6.5 13.16,1.27 56.83,1.27 J2.3
  Bottom 0.302: 56.41,2.68 J2.3 | 32.91,48.68 36.41,45.18 v36.41,38.18 | v46.91,77.18 46.41,76.68 46.41,69.18 42.91,65.68 42.91,58.68 32.91,48.68 | 32.91,48.68 B2.LV | v22.91,31.13 22.91,20.68 19.91,20.68 18.41,19.18 B5.LV
WAIT_
  Bottom 0.302: IC6.6 73.91,80.68 73.27,80.68 71.41,82.55 71.41,88.18 69.91,89.68 J3-WAIT.4
WIFI_IN
  Bottom 0.302: IC7.1 20.91,30.68 19.91,31.68 19.91,35.68 13.9,41.68 IC5.4
WIFI_IN_  (via drill 0.35)
  Top 0.302: v46.41,42.68 43.41,39.68 27.95,39.68 26.45,38.18 19.91,38.18 16.41,41.68 IC5.3
  Bottom 0.302: IC7.5 11.4,30.68 12.4,31.68 12.4,45.18 13.4,46.18 IC4.11 13.9,45.68 13.9,44.68 14.4,44.18 14.4,43.68 15.9,42.18 IC5.3 | 52.91,67.18 52.91,68.18 54.91,70.18 54.91,72.68 55.41,73.18 55.41,74.18 IC10.19 | 52.91,67.18 52.91,66.68 IC10.1 52.91,67.18 | 52.91,67.18 50.41,64.68 50.41,51.68 49.91,51.18 B4.HV1 49.41,50.68 49.41,50.18 47.95,48.73 47.95,44.23 v46.41,42.68
WIFI_IN_LV_
  Bottom 0.302: B4.LV1 49.41,40.18 49.41,39.68 48.41,38.68 48.41,13.68 47.54,12.82 47.5,12.87 47,12.87 U$1.P$6
WIFI_IN_OR_OUT
  Top 0.302: IC7.8 5.91,23.18 1.91,27.18 1.91,80.23 1.41,80.73 1.41,91.68 21.91,91.68 24.91,88.68 44.91,88.68 45.77,89.55 45.77,92.64 47.31,94.18 69.91,94.18 71.91,92.18 71.91,89.98 73.53,88.36 73.96,88.36 IC6.3
WIFI_OUT  (via drill 0.35)
  Top 0.302: 54.91,68.68 56.41,70.18 v74.41,70.18 | 54.91,68.68 v54.41,68.18 | 54.91,68.68 52.41,68.68 47.41,63.68 31.91,63.68 28.91,60.68 3.77,60.68 3.77,44.23 4.32,43.68 6.91,43.68 8.4,42.18 IC5.6 8.57,39.05 8.89,38.73 11.85,38.73 12.4,38.18 12.4,32.07 13.65,30.82 IC7.4
  Bottom 0.302: v54.41,68.18 54.41,65.18 52.91,63.68 52.91,55.68 51.91,54.68 IC9.11 | v74.41,70.18 79.41,75.18 79.41,84.18 81.41,86.18 IC6.11
WIFI_OUT_  (via drill 0.35)
  Top 0.302: 17.41,36.68 17.41,32.68 18.41,31.68 18.41,30.68 IC7.2 | IC4.8 6.41,45.68 8.4,43.68 9.4,43.68 10.9,42.18 IC5.5 11.4,41.68 16.41,36.68 17.41,36.68 | v49.41,42.68 45.91,39.18 29.41,39.18 25.91,35.68 22.41,35.68 21.41,36.68 17.41,36.68
  Bottom 0.302: v49.41,42.68 49.41,47.87 52.33,50.79 B4.HV2
WIFI_OUT_LV_  (via drill 0.35)
  Top 0.302: v49.41,15.18 47.41,15.18 45.04,12.82 45,12.87 44.5,12.87 U$1.P$5
  Bottom 0.302: v49.41,15.18 50.91,16.68 50.91,38.68 51.91,39.68 51.91,40.18 B4.LV2
WIFI_OUT_OUTPUT_ENABLE_
  Bottom 0.302: IC9.1 74.91,62.68 74.91,63.18 81.41,69.68 81.41,77.68 IC6.8

### Text on the board
tPlace: ESP32 V1.2 / Rounceville | D1 | D3 | D5 | D7 | RAS* | CAS* | SYSRES* | INTAK* | 3.3V | GND | 5V | D0 | D2 | D4 | D6
tNames: A0 | A2 | A4 | A6 | A8 | A10 | A12 | A14 | IN* | RD* | A1 | A3 | A5 | A7 | A9 | A11 | A13 | A15 | OUT* | WR* | A0 | A1 | A2 | A3 | A4 | A5 | A6 | A7